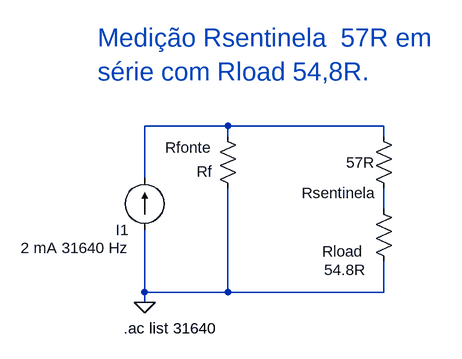
[diagram p0: schematic Med_Resistencia_interna_FCorrente.asc]
Med_Resistencia_interna_FCorrente.asc, the LTspice schematic file:
Version 4
SHEET 1 1208 680
WIRE -432 128 -560 128
WIRE -192 128 -432 128
WIRE -432 144 -432 128
WIRE -192 144 -192 128
WIRE -560 208 -560 128
WIRE -192 256 -192 224
WIRE -560 384 -560 288
WIRE -432 384 -432 224
WIRE -432 384 -560 384
WIRE -192 384 -192 336
WIRE -192 384 -432 384
WIRE -560 400 -560 384
FLAG -560 400 0
SYMBOL res -208 128 R0
WINDOW 0 -110 103 Left 2
WINDOW 3 -42 56 Left 2
SYMATTR InstName Rsentinela
SYMATTR Value 57R
SYMBOL res -448 128 R0
WINDOW 0 -80 33 Left 2
WINDOW 3 -32 70 Left 2
SYMATTR InstName Rfonte
SYMATTR Value Rf
SYMBOL current -560 288 R180
WINDOW 3 24 -28 Left 2
WINDOW 123 63 58 Left 2
WINDOW 39 0 0 Left 0
SYMATTR Value 2 mA 31640 Hz
SYMATTR InstName I1
SYMBOL res -208 240 R0
WINDOW 0 -79 81 Left 2
WINDOW 3 -76 110 Left 2
SYMATTR InstName Rload
SYMATTR Value 54.8R
TEXT -592 440 Left 2 !.ac list 31640
TEXT -632 -8 Left 4 ;Medição Rsentinela  57R em \nsérie com Rload 54,8R.

The netlist it stands for:
* Med_Resistencia_interna_FCorrente.asc
Rsentinela N001 N002 57R
Rfonte N001 0 Rf
I1 0 N001 2 mA 31640 Hz
Rload N002 0 54.8R
.ac list 31640
* Medição Rsentinela  57R em
* série com Rload 54,8R.
.backanno
.end